# Altium schematic sheet 2_Airframe-Power_2.SchDoc
size A3; SheetNumber: 3; SheetTotal: 9
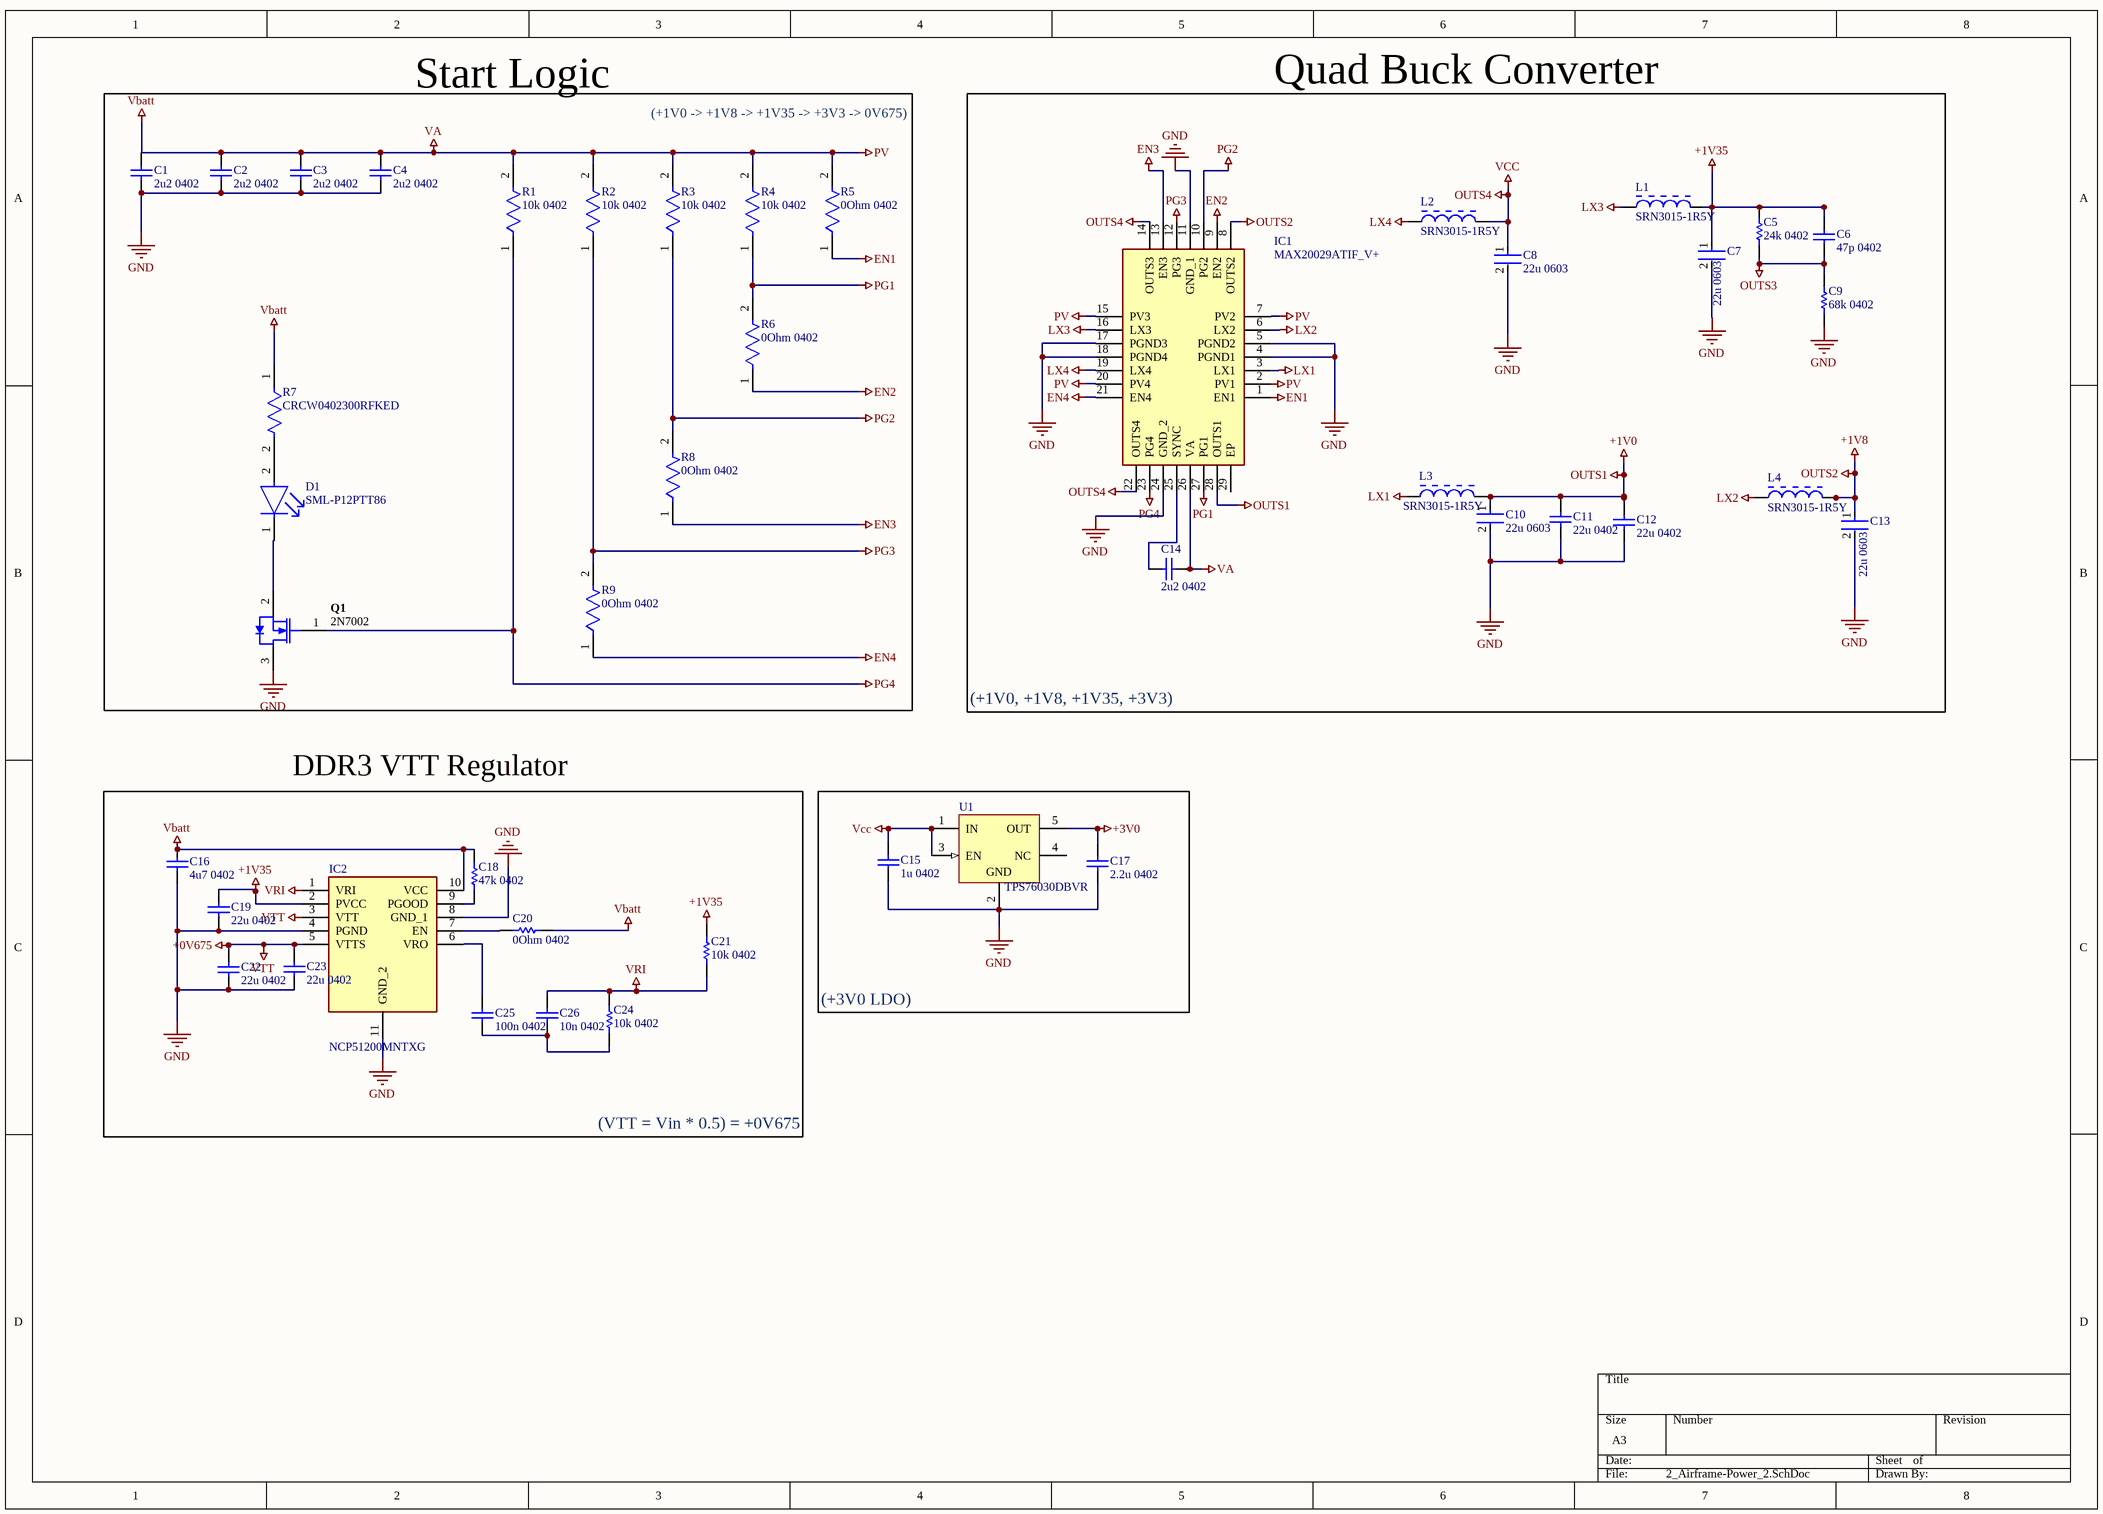
[diagram p0: 2_Airframe-Power_2.SchDoc]

## Parts
C1  2u2 0402  [CAPC1005X55X25ML5T10]
C2  2u2 0402  [CAPC1005X55X25ML5T10]
C3  2u2 0402  [CAPC1005X55X25ML5T10]
C4  2u2 0402  [CAPC1005X55X25ML5T10]
C5  24k 0402  [RESC1608X55X25ML10T15]
C6  47p 0402  [CAPC1005X55X25ML5T10]
C7  22u 0603  [FP-GRM188-0_2-IPC_C]
C8  22u 0603  [FP-GRM188-0_2-IPC_C]
C9  68k 0402  [RESC1608X55X25ML10T15]
C10  22u 0603  [FP-GRM188-0_2-IPC_C]
C11  22u 0402  [CAPC1005X55X25ML5T10]
C12  22u 0402  [CAPC1005X55X25ML5T10]
C13  22u 0603  [FP-GRM188-0_2-IPC_C]
C14  2u2 0402  [CAPC1005X55X25ML5T10]
C15  1u 0402  [CAPC1005X55X25ML5T10]
C16  4u7 0402  [CAPC1005X55X25ML5T10]
C17  2.2u 0402  [CAPC1005X55X25ML5T10]
C18  47k 0402  [RESC1608X55X25ML10T15]
C19  22u 0402  [CAPC1005X55X25ML5T10]
C20  0Ohm 0402  [RESC1608X55X25ML10T15]
C21  10k 0402  [RESC1608X55X25ML10T15]
C22  22u 0402  [CAPC1005X55X25ML5T10]
C23  22u 0402  [CAPC1005X55X25ML5T10]
C24  10k 0402  [RESC1608X55X25ML10T15]
C25  100n 0402  [CAPC1005X55X25ML5T10]
C26  10n 0402  [CAPC1005X55X25ML5T10]
D1  SML-P12PTT86  [FP-SML-P1-MFG]
IC1  MAX20029ATIF_V+  [QFN50P500X500X80-29N]
IC2  NCP51200MNTXG  [SON50P300X300X100-11N]
L1  SRN3015-1R5Y  [BOUR-SRN3015-2_V]
L2  SRN3015-1R5Y  [BOUR-SRN3015-2_V]
L3  SRN3015-1R5Y  [BOUR-SRN3015-2_V]
L4  SRN3015-1R5Y  [BOUR-SRN3015-2_V]
Q1  2N7002  [INF-PG-SOT23_N]
R1  10k 0402  [FP-CRCW0402-e3-IPC_C]
R2  10k 0402  [FP-CRCW0402-e3-IPC_C]
R3  10k 0402  [FP-CRCW0402-e3-IPC_C]
R4  10k 0402  [FP-CRCW0402-e3-IPC_C]
R5  0Ohm 0402  [FP-CRCW0402-e3-IPC_C]
R6  0Ohm 0402  [FP-CRCW0402-e3-IPC_C]
R7  CRCW0402300RFKED  [FP-CRCW0402-e3-MFG]
R8  0Ohm 0402  [FP-CRCW0402-e3-IPC_C]
R9  0Ohm 0402  [FP-CRCW0402-e3-IPC_C]
U1  TPS76030DBVR  [DBV0005A_N]

## Blocks framed on the sheet
(+1V0 -> +1V8 -> +1V35 -> +3V3 -> 0V675): C1-C4 D1 Q1 R1-R9
(+1V0, +1V8, +1V35, +3V3): C5-C14 IC1 L1-L4
(VTT = Vin * 0.5) = +0V675: C16 C18-C26 IC2
(+3V0 LDO): C15 C17 U1

## Nets
+0V675: C22.1 C23.1 IC2.3(VTT) IC2.5(VTTS)  [also labelled VTT]
+1V0: C10.1 C11.1 C12.1 IC1.28(OUTS1) L3.2  [also labelled OUTS1]
+1V8: C13.1 IC1.8(OUTS2) L4.2  [also labelled OUTS2]
+1V35: C5.2 C6.1 C7.1 C19.1 C21.1 IC2.2(PVCC) L1.2
+3V0: C17.1 U1.5(OUT)
EN1: IC1.1(EN1) R5.1
EN2: IC1.9(EN2) R6.1
EN3: IC1.13(EN3) R8.1
EN4: IC1.21(EN4) R9.1
GND: C1.2 C2.2 C3.2 C4.2 C7.2 C8.2 C9.1 C10.2 C11.2 C12.2 C13.2 C15.2 C16.2 C17.2 C19.2 C22.2 C23.2 IC1.4(PGND1) IC1.5(PGND2) IC1.11(GND_1) IC1.17(PGND3) IC1.18(PGND4) IC1.24(GND_2) IC2.4(PGND) IC2.8(GND_1) IC2.11(GND_2) Q1.3(DRAIN) U1.2(GND)
LX1: IC1.3(LX1) L3.1
LX2: IC1.6(LX2) L4.1
LX3: IC1.16(LX3) L1.1
LX4: IC1.19(LX4) L2.1
OUTS3: C5.1 C6.2 C9.2
OUTS4: C8.1 C15.1 IC1.14(OUTS3) IC1.22(OUTS4) L2.2 U1.1(IN) U1.3(EN)  [also labelled VCC]
PG1: IC1.27(PG1) R4.1 R6.2
PG2: IC1.10(PG2) R3.1 R8.2
PG3: IC1.12(PG3) R2.1 R9.2
PG4: IC1.23(PG4) Q1.1(GATE) R1.1
PV: C1.1 C2.1 C3.1 C4.1 C14.1 IC1.2(PV1) IC1.7(PV2) IC1.15(PV3) IC1.20(PV4) IC1.26(VA) R1.2 R2.2 R3.2 R4.2 R5.2  [also labelled VA]
Vbatt: C16.1 C18.2 C20.1 IC2.10(VCC) R7.1
VRI: C21.2 C24.1 C26.1 IC2.1(VRI)
NetC14_2: C14.2 IC1.25(SYNC)
NetC18_1: C18.1 IC2.9(PGOOD)
NetC20_2: C20.2 IC2.7(EN)
NetC24_2: C24.2 C25.2 C26.2
NetC25_1: C25.1 IC2.6(VRO)
NetD1_1: D1.1(C) Q1.2(SOURCE)
NetD1_2: D1.2(A) R7.2

Not connected (* = marked no-connect by the designer): IC1 29(EP); U1 4(NC)

## Notes on the sheet
- Start Logic
- Quad Buck Converter
- DDR3 VTT Regulator

## Library data of the parts
C1-C4 C6 C11 C12 C14-C17 C19 C22 C23 C25 C26 = CMP-1662-00017-1: Chip Capacitor, 1 nF, +/- 10%, 50 V, -55 to 125 degC, 0402 (1005 Metric), RoHS, Tape and Reel; Case\/Package: 0402; Type (Capacitors): X7R; Voltage Rating (DC): 50 V; Capacitance: 1 nF; Width: 0.5 mm; Pins: 2; REACH SVHC: No SVHC; Length: 1 mm; Height: 0.5 mm; PackageDescription: 2-Pin Surface Mount Device, Body 1 x 0.5 mm; DatasheetVersion: 07/2016; Mount: Surface Mount; ComponentLink2Description: Datasheet; Tolerance: 10%; ComponentLink2URL: http://psearch.en.murata.com/capacitor/product/GRM155R71H102KA01%23.pdf; ComponentLink1URL: http://www.murata.com/; Case Code (Metric): 1005; Package Quantity: 10000; Min Operating Temperature: -55 degC; Max Operating Temperature: 125 degC; Voltage Rating: 50 V; ComponentLink1Description: Manufacturer URL; Packaging: Tape and Reel; Radiation Hardening: No; RoHSCompliant: true; PackageReference: 0402; Mounting Technology: Surface Mount; Case Code (Imperial): 0402
C5 C9 C18 C20 C21 C24 = CMP-2100-03667-1: Chip Resistor, 0 Ohm, +/- 5%, 0.1 W, -55 to 155 degC, 0603 (1608 Metric), RoHS, Tape and Reel; Manufacturer: Yageo; Temperature Coefficient: 200ppm/degreesC; Voltage Rating: 50V; Power Rating: 100mW; Resistance: 0mOhm; Width: 0.8mm; Max Operating Temperature: 155degC; Tolerance: 5%; Package Reference: 0603; Height: 0.45mm; Depth: 0.8mm; Package Description: 2-Pin Surface Mount Device, Body 1.6 x 0.8 mm; Termination: SMD/SMT; Package Quantity: 5000; Case/Package: 0603; Case Code (Imperial): 0603; Radiation Hardening: No; Number of Pins: 2; Length: 1.6mm; Lead Free: LeadFree; Voltage Rating (DC): 50V; Military Standard: Not; Datasheet URL: http://www.yageo.com/NewPortal/yageodocoutput?fileName=/pdf/R-Chip/PYu-RC_Group_51_RoHS_L_5.pdf; Manufacturer URL: http://www.yageo.com/; Packaging: TapeandReel; Case Code (Metric): 1608; Min Operating Temperature: -55degC; Composition: ThickFilm; RoHSCompliant: true; Contact Plating: Tin; Datasheet Version: Rev. 5, 10/2016; REACH SVHC: NoSVHC
C7 C8 C10 C13 = CMP-2000-06337-3: Chip Multilayer Ceramic Capacitors for General Purpose, 0603, 22uF, X5R, 15%, 20%, 10V; Tolerance: 20%; Weight: 0.000222oz; Material: Ceramic; Depth: 0.8mm; Length: 1.6mm; Termination: SMD/SMT; Capacitance: 22uF; Packaging: Tape and Reel; Width: 0.8mm; Voltage Rating: 10V; Case Code (Imperial): 0603; Mount: Surface Mount; Voltage Rating (DC): 10V; Case/Package: 0603; Thickness: 0.039inch; REACH SVHC: No SVHC; Dielectric: X5R; Height: 0.8mm; Package Quantity: 4000; Case Code (Metric): 1608; Min Operating Temperature: -55°C; Lead Free: Lead Free; Max Operating Temperature: 85°C
D1 = CMP-08952-000020-1: LED GREEN CLEAR 1006 SMD; Manufacturer: Rohm; Led Orientation: Top View; Wavelength: 560nm; Forward Current: 20mA; Reverse Voltage: 5V; Power Dissipation: 52mW; Forward Voltage: 2.1V; Luminous Intensity: 10mcd; Device Class L1: Optoelectronics; Digikey Description: LED GREEN CLEAR 1006 SMD; Lead Free: Yes; Manufacturer Part Number: SML-P12PTT86; Temperature Range High: +85°C; Octopart: https://octopart.com/sml-p12ptt86-rohm-9290705; Device Class L2: LEDs; Colour: Green; RoHS: TRUE; Height: 0.25mm; Automotive: No; Device Class L3: unset; Temperature Range Low: -40°C; ComponentLink2Description: Datasheet; Mouser Description: Standard LEDs - SMD SMD Green 13 mcd height=0.2; Category: Diode; ComponentLink2URL: https://www.rohm.com/datasheet/SML-P12DT(R); Temperature: -40°C to +85°C; Package: SML-P1
IC1 = MAX20029ATIF_V+: Integrated Circuit; Manufacturer_Name: Maxim Integrated; Manufacturer_Part_Number: MAX20029ATIF/V+; Datasheet Link: https://datasheets.maximintegrated.com/en/ds/MAX20029-MAX20029D.pdf; Height: 0.8mm; Mouser Part Number: 700-MAX20029ATIF/V+; Mouser Price/Stock: https://www.mouser.co.uk/ProductDetail/Maxim-Integrated/MAX20029ATIF-V%2b?qs=uwxL4vQweFOl5TBKmLtmFg%3D%3D; Arrow Part Number: MAX20029ATIF/V+; Arrow Price/Stock: https://www.arrow.com/en/products/max20029atifv/maxim-integrated?region=nac
IC2 = NCP51200MNTXG: Integrated Circuit; Manufacturer_Name: onsemi; Datasheet Link: http://www.onsemi.com/pub/Collateral/NCP51200-D.PDF; Height: 1mm; Manufacturer_Part_Number: NCP51200MNTXG; Mouser Part Number: 863-NCP51200MNTXG; Mouser Price/Stock: https://www.mouser.co.uk/ProductDetail/onsemi/NCP51200MNTXG?qs=mt7EBqA2jzgnxcGILBvARw%3D%3D; Arrow Part Number: NCP51200MNTXG; Arrow Price/Stock: https://www.arrow.com/en/products/ncp51200mntxg/on-semiconductor?region=europe
L1-L4 = CMP-0007-00008-1: Semi-shielded Power Inductor, 1.5 uH, +/- 30%, 2.1 A, -40 to 125 degC, 3 x 3 x 1.5 mm SMD, RoHS and Halogen Free, Tape and Reel; Manufacturer: Bourns; SRF Min: 130 MHz; Rated current: 2.1 A; DCR Max: 0.066 Ohm; Inductance: 1.5 uH; Isat: 2 A; Inductance tolerance: +/- 30%; Resistance to Solder Heat: +260 degC for 10 sec.; RoHS: TRUE; Mounting Technology: Surface Mount; ComponentLink1Description: Manufacturer URL; ComponentLink1URL: http://www.bourns.com/; PartNumber: SRN3015-1R5Y; ComponentLink3Description: Package Specification; ComponentLink3URL: http://www.bourns.com/data/global/pdfs/SRN3015.pdf; Operating Temperature: -40 to 125 degC; PackageReference: SRN3015; DatasheetVersion: Aug-11; Packing: Tape and Reel; ComponentLink2Description: Datasheet; PackageDescription: 2-Pin SMD, Body 3 x 3 mm, Height 1.5 mm; ComponentLink2URL: http://www.bourns.com/data/global/pdfs/SRN3015.pdf
Q1 = CMP-1149-00026-1: N-Channel OptiMOS Small-Signal-Transistor, 60 V VDS, 0.3 A ID, -55 to 150 degC, PG-SOT23, Reel, Green; Manufacturer: Infineon; RDS (on) (max) (@4.5V): 4,000 mOhm; VDS (max): 60 V; IDpuls (max): 1.2Â A; QG: 0.4Â nC; RDS (on) (max): 3,000 mOhm; RthJA (max): 250 K/W; ID (max): 0.3Â A; VGS(th) (max): 2.5Â V; VGS(th) (min): 1.5Â V; Green: TRUE; Ptot (max): 0.5Â W; PackageDescription: 3-Pin Small Outline Transistor Package, 2.9 x 1.3 mm Body, 0.95 mm Pitch; Halogen-free: TRUE; ComponentLink2Description: Datasheet; ComponentLink1URL: http://www.infineon.com/; Packing: Reel; DatasheetVersion: Rev. 2.4; PartNumber: 2N7002; PackageReference: PG-SOT23; PackageVersion: Apr-08; ComponentLink3URL: http://www.infineon.com/dgdl/SOT23-Package_Overview.pdf?folderId=db3a30431936bc4b0119532290053c66&fileId=db3a30431936bc4b0119533468123c85; ComponentLink1Description: Manufacturer URL; Mounting Technology: Surface Mount; ComponentLink3Description: Package Specification; ComponentLink2URL: http://www.infineon.com/dgdl/2N7002_Rev2.4.pdf?folderId=db3a3043156fd573011622e10b5c1f67&fileId=db3a304319bc939a0119c2a9461e79e6
R1-R6 R8 R9 = CMP-2002-08122-2: RES Thick Film, 0Ω, 0.063W, 0402; Tolerance: 5%; Max Power Dissipation: 63mW; Voltage Rating: 50V; Temperature Coefficient: 100ppm/°C; Resistance: 0mR; Contact Plating: Tin; Height: 0.35mm; Radiation Hardening: No; Features: Automotive AEC-Q200; Composition: Thick Film; Width: 0.5mm; Weight: 2.3E-05oz; Termination: SMD/SMT; Packaging: Tape and Reel; Mount: Surface Mount; Case Code (Metric): 1005; Military Standard: Not; Min Operating Temperature: -55°C; Number of Terminations: 2; Package Quantity: 1; Case Code (Imperial): 0402; Depth: 0.5mm; Max Operating Temperature: 155°C; Case/Package: 0402; Power Rating: 63mW; Lead Free: Lead Free; Voltage Rating (DC): 50V; Length: 1mm
R7 = CMP-2002-08497-2: RES Thick Film, 300Ω, 1%, 0.063W, 100ppm/°C, 0402; Voltage Rating: 50V; Resistance: 300R; Max Power Dissipation: 63mW; Depth: 0.5mm; Tolerance: 1%; Package Quantity: 10; Temperature Coefficient: 100ppm/°C; Features: Automotive AEC-Q200; Military Standard: Not; Case Code (Metric): 1005; Voltage Rating (DC): 50V; Case/Package: 0402; Lead Free: Lead Free; Contact Plating: Tin; Min Operating Temperature: -55°C; Length: 1mm; Number of Terminations: 2; Case Code (Imperial): 0402; Weight: 2.3E-05oz; Mount: Surface Mount; Termination: SMD/SMT; Max Operating Temperature: 155°C; Width: 0.02inch; Composition: Thick Film; Height: 0.35mm; Power Rating: 63mW; Radiation Hardening: No; Packaging: Tape and Reel
U1 = CMP-0394-00493-2: Single Output LDO, 50 mA, Fixed 3 V Output, 3.2 to 16 V Input, with Low IQ, 5-pin SOT-23 (DBV), -40 to 125 degC, Green (RoHS & no Sb/Br); Manufacturer: Texas Instruments; Accuracy(%): 2; Vin(Max)(V): 16; Iq(Typ)(mA): 0.8; Iout(Max)(A): 0.05; Vin(Min)(V): 3.2; Vout Adj(Max)(V): 3; SubFamily: Single Channel LDO; Vdo(Typ)(mV): 120; Rating: Catalog; ComponentLink1URL: http://www.ti.com/; ComponentLink1Description: Manufacturer URL; Code_JEDEC: MO-178; PackageDescription: 5-Pin Plastic Small Outline, Body 1.60 Ãƒâ€” 2.90 mm, Pitch 0.95 mm; PartNumber: TPS76030DBVR; ComponentLink2Description: Datasheet; Mounting Technology: Surface Mount; ComponentLink3Description: Package Specification; ComponentLink2URL: http://www.ti.com/general/docs/lit/getliterature.tsp?genericPartNumber=TPS76030&fileType=pdf; ComponentLink3URL: http://www.ti.com/litv/pdf/mpds018i; Eco-Plan: Green (RoHS & no Sb/Br); DatasheetVersion: SLVS144D; PackageVersion: 4073253-4/K; Fixed Output Options(V): 3; Vout Adj(Min)(V): 3; PackageReference: DBV0005A